# Altium project 电子天平.PrjPcb
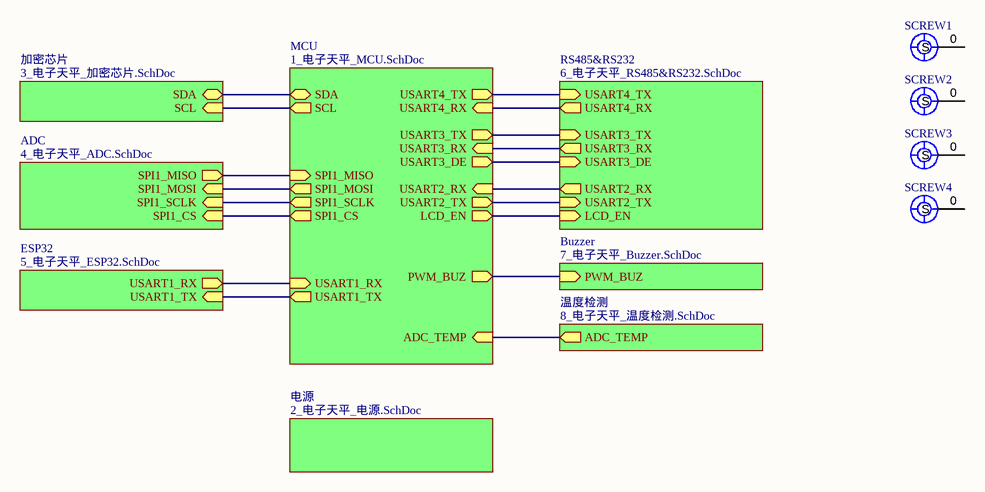
[diagram p0: 0_电子天平.SchDoc]
9 sheets, 163 parts. Net scope: hierarchical (ports join the sheet entries above them; power ports are global).
Board file: 电子天平.PcbDoc
Sheets:
  0_电子天平.SchDoc
    MCU = 1_电子天平_MCU.SchDoc
    电源 = 2_电子天平_电源.SchDoc
    加密芯片 = 3_电子天平_加密芯片.SchDoc
    ADC = 4_电子天平_ADC.SchDoc
    ESP32 = 5_电子天平_ESP32.SchDoc
    RS485&RS232 = 6_电子天平_RS485&RS232.SchDoc
    Buzzer = 7_电子天平_Buzzer.SchDoc
    温度检测 = 8_电子天平_温度检测.SchDoc

## Sheet 0_电子天平.SchDoc: 电子天平
size A4; Date: 2020/01/07; ApprovedBy: Riggin; CheckedBy: Riggin; Author: Riggin; DrawnBy: Riggin; Engineer: Riggin; DocumentNumber: 1; Revision: V1.0; SheetNumber: 1; SheetTotal: 8; Time: 14:09:34; ProjectName: 电子天平

### Parts
SCREW1  (no value)  [SCREW_M3]
SCREW2  (no value)  [SCREW_M3]
SCREW3  (no value)  [SCREW_M3]
SCREW4  (no value)  [SCREW_M3]

### Sub-sheets
ADC = 4_电子天平_ADC.SchDoc: SPI1_SCLK (in), SPI1_MOSI (in), SPI1_CS (in), SPI1_MISO (out)
Buzzer = 7_电子天平_Buzzer.SchDoc: PWM_BUZ (in)
ESP32 = 5_电子天平_ESP32.SchDoc: USART1_TX (in), USART1_RX (out)
MCU = 1_电子天平_MCU.SchDoc: SDA (bidir), SCL (out), USART2_TX (out), USART2_RX (in), PWM_BUZ (out), USART4_TX (out), USART4_RX (in), LCD_EN (out), USART3_RX (in), USART3_TX (out), USART3_DE (out), SPI1_SCLK (out), SPI1_MOSI (out), SPI1_CS (out), SPI1_MISO (in), USART1_TX (out), USART1_RX (in), ADC_TEMP (in)
RS485&RS232 = 6_电子天平_RS485&RS232.SchDoc: USART4_TX (in), USART4_RX (out), LCD_EN (in), USART3_RX (out), USART3_TX (in), USART3_DE (in), USART2_TX (in), USART2_RX (out)
加密芯片 = 3_电子天平_加密芯片.SchDoc: SDA (bidir), SCL (in)
温度检测 = 8_电子天平_温度检测.SchDoc: ADC_TEMP (out)
电源 = 2_电子天平_电源.SchDoc: no entries

### Nets
ADC_TEMP: sheet MCU/ADC_TEMP, sheet 温度检测/ADC_TEMP
LCD_EN: sheet MCU/LCD_EN, sheet RS485&RS232/LCD_EN
PWM_BUZ: sheet MCU/PWM_BUZ, sheet Buzzer/PWM_BUZ
SCL: sheet MCU/SCL, sheet 加密芯片/SCL
SDA: sheet MCU/SDA, sheet 加密芯片/SDA
SPI1_CS: sheet MCU/SPI1_CS, sheet ADC/SPI1_CS
SPI1_MISO: sheet MCU/SPI1_MISO, sheet ADC/SPI1_MISO
SPI1_MOSI: sheet MCU/SPI1_MOSI, sheet ADC/SPI1_MOSI
SPI1_SCLK: sheet MCU/SPI1_SCLK, sheet ADC/SPI1_SCLK
USART1_RX: sheet MCU/USART1_RX, sheet ESP32/USART1_RX
USART1_TX: sheet MCU/USART1_TX, sheet ESP32/USART1_TX
USART2_RX: sheet MCU/USART2_RX, sheet RS485&RS232/USART2_RX
USART2_TX: sheet MCU/USART2_TX, sheet RS485&RS232/USART2_TX
USART3_DE: sheet MCU/USART3_DE, sheet RS485&RS232/USART3_DE
USART3_RX: sheet MCU/USART3_RX, sheet RS485&RS232/USART3_RX
USART3_TX: sheet MCU/USART3_TX, sheet RS485&RS232/USART3_TX
USART4_RX: sheet MCU/USART4_RX, sheet RS485&RS232/USART4_RX
USART4_TX: sheet MCU/USART4_TX, sheet RS485&RS232/USART4_TX

Not connected (* = marked no-connect by the designer): SCREW1 0(S); SCREW2 0(S); SCREW3 0(S); SCREW4 0(S)

### Notes on the sheet
- Title
- Company:
- Address:
- 广东省广州市
- DZT Studio
- Size:
- Date:
- Drawn By:
- A4
- Riggin
- Time:
- Revision:
- Approved By:
- Sheet
- of
- Email:
- RigginLi@icloud.com
- Project:

### Library data of the parts
SCREW1-SCREW4 = SCREW: M3 螺丝孔/定位孔

## Sheet 1_电子天平_MCU.SchDoc: 电子天平_MCU
size A4; Date: 2020/01/07; ApprovedBy: Riggin; CheckedBy: Riggin; Author: Riggin; DrawnBy: Riggin; Engineer: Riggin; DocumentNumber: 2; Revision: V1.0; SheetNumber: 2; SheetTotal: 8; Time: 14:09:34; ProjectName: 电子天平
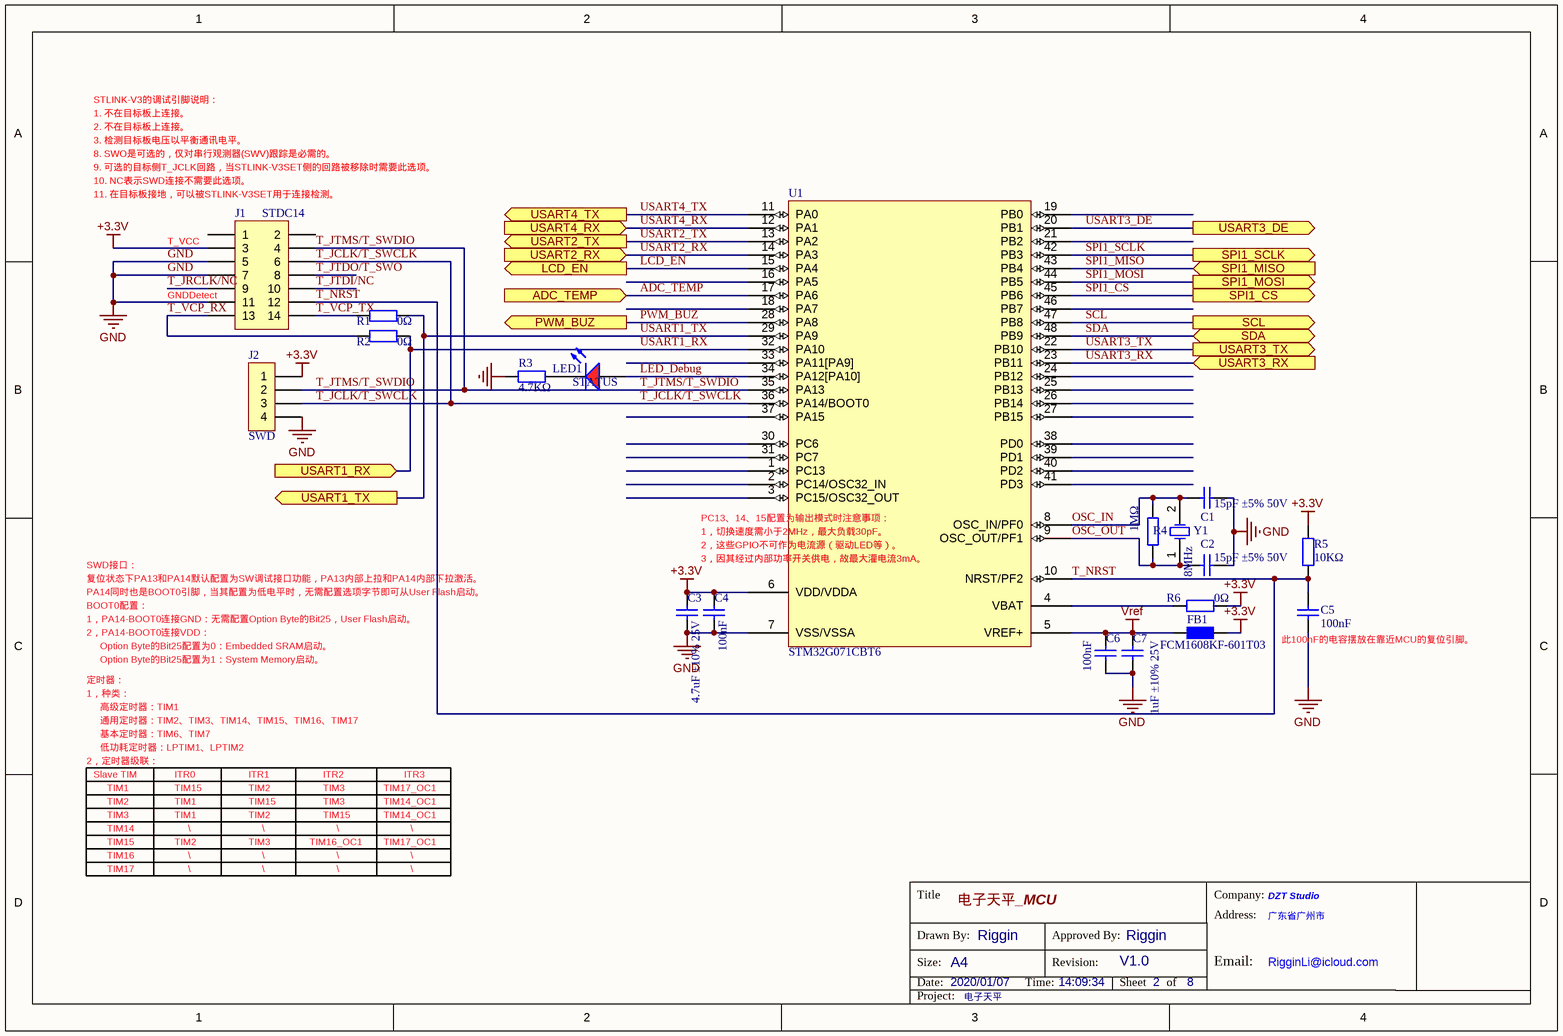
[diagram p1: 1_电子天平_MCU.SchDoc]

### Parts
C1  15pF ±5% 50V  [LC-0805_C]
C2  15pF ±5% 50V  [LC-0805_C]
C3  4.7uF ±10% 25V  [LC-0805_C]
C4  100nF  [LC-0805_C]
C5  100nF  [LC-0805_C]
C6  100nF  [LC-0805_C]
C7  1uF ±10% 25V  [LC-0805_C]
FB1  FCM1608KF-601T03  [LC-0603_L]
J1  STDC14  [CON-FTSH-107-01-L-DV-K]
J2  SWD  [CON-PH2.0-4P-DIP]
LED1  STATUS  [LC-0805_LED_S1]
R1  0Ω  [LC-0805_R]
R2  0Ω  [LC-0805_R]
R3  4.7KΩ  [LC-0805_R]
R4  1MΩ  [LC-0805_R]
R5  10KΩ  [LC-0805_R]
R6  0Ω  [LC-0805_R]
U1  STM32G071CBT6  [LC-LQFP-48_7x7x05P]
Y1  8MHz  [3225_XT_2P]

### Ports
ADC_TEMP (in), LCD_EN (out), PWM_BUZ (out), SCL (out), SDA (bidir), SPI1_CS (out), SPI1_MISO (in), SPI1_MOSI (out), SPI1_SCLK (out), USART1_RX (in), USART1_TX (out), USART2_RX (in), USART2_TX (out), USART3_DE (out), USART3_RX (in), USART3_TX (out), USART4_RX (in), USART4_TX (out)

### Nets
+3.3V: C3.1 C4.1 FB1.1 J1.3 J2.1 R5.2 R6.1 U1.6(VDD/VDDA)
GND: C1.1 C2.1 C3.2 C4.2 C5.2 C6.2 C7.2 J1.5 J1.7 J1.11 J2.4 R3.2 U1.7(VSS/VSSA)
Vref: C6.1 C7.1 FB1.2 U1.5(VREF+)
ADC_TEMP: U1.17(PA6) ; port ADC_TEMP
LCD_EN: U1.15(PA4) ; port LCD_EN
LED_Debug: LED1.A U1.34(PA12[PA10])
OSC_IN: C1.2 R4.2 U1.8(OSC_IN/PF0) Y1.2(OSC2)
OSC_OUT: C2.2 R4.1 U1.9(OSC_OUT/PF1) Y1.1(OSC1)
PWM_BUZ: U1.28(PA8) ; port PWM_BUZ
SCL: U1.47(PB8) ; port SCL
SDA: U1.48(PB9) ; port SDA
SPI1_CS: U1.45(PB6) ; port SPI1_CS
SPI1_MISO: U1.43(PB4) ; port SPI1_MISO
SPI1_MOSI: U1.44(PB5) ; port SPI1_MOSI
SPI1_SCLK: U1.42(PB3) ; port SPI1_SCLK
T_JCLK/T_SWCLK: J1.6 J2.3 U1.36(PA14/BOOT0)
T_JRCLK/NC: J1.9
T_JTDI/NC: J1.10
T_JTDO/T_SWO: J1.8
T_JTMS/T_SWDIO: J1.4 J2.2 U1.35(PA13)
T_NRST: C5.1 J1.12 R5.1 U1.10(NRST/PF2)
T_VCP_RX: J1.13 R2.2
T_VCP_TX: J1.14 R1.2
USART1_RX: R2.1 U1.32(PA10) ; port USART1_RX
USART1_TX: R1.1 U1.29(PA9) ; port USART1_TX
USART2_RX: U1.14(PA3) ; port USART2_RX
USART2_TX: U1.13(PA2) ; port USART2_TX
USART3_DE: U1.20(PB1) ; port USART3_DE
USART3_RX: U1.23(PB11) ; port USART3_RX
USART3_TX: U1.22(PB10) ; port USART3_TX
USART4_RX: U1.12(PA1) ; port USART4_RX
USART4_TX: U1.11(PA0) ; port USART4_TX
NetLED1_K: LED1.K R3.1
NetR6_2: R6.2 U1.4(VBAT)

Not connected (* = marked no-connect by the designer): J1 1 2; U1 1(PC13) 2(PC14/OSC32_IN) 3(PC15/OSC32_OUT) 16(PA5) 18(PA7) 19(PB0) 21(PB2) 24(PB12) 25(PB13) 26(PB14) 27(PB15) 30(PC6) 31(PC7) 33(PA11[PA9]) 37(PA15) 38(PD0) 39(PD1) 40(PD2) 41(PD3) 46(PB7)

### Notes on the sheet
- 1. 不在目标板上连接。
- STLINK-V3的调试引脚说明：
- 3. 检测目标板电压以平衡通讯电平。
- 8. SWO是可选的，仅对串行观测器(SWV)跟踪是必需的。
- 9. 可选的目标侧T_JCLK回路，当STLINK-V3SET侧的回路被移除时需要此选项。
- 2. 不在目标板上连接。
- 10. NC表示SWD连接不需要此选项。
- (near J1) 11. 在目标板接地，可以被STLINK-V3SET用于连接检测。
- (near J1) T_VCC
- (near J1) GNDDetect
- (near U1) PC13、14、15配置为输出模式时注意事项：
- 复位状态下PA13和PA14默认配置为SW调试接口功能，PA13内部上拉和PA14内部下拉激活。
- SWD接口：
- (near U1) 1，切换速度需小于2MHz，最大负载30pF。
- (near U1) 2，这些GPIO不可作为电流源（驱动LED等）。
- (near U1) 3，因其经过内部功率开关供电，故最大灌电流3mA。
- BOOT0配置：
- 1，PA14-BOOT0连接GND：无需配置Option Byte的Bit25，User Flash启动。
- 2，PA14-BOOT0连接VDD：
- PA14同时也是BOOT0引脚，当其配置为低电平时，无需配置选项字节即可从User Flash启动。
- Option Byte的Bit25配置为0：Embedded SRAM启动。
- (near C5) 此100nF的电容摆放在靠近MCU的复位引脚。
- 定时器：
- 1，种类：
- Option Byte的Bit25配置为1：System Memory启动。
- 高级定时器：TIM1
- 2，定时器级联：
- Slave TIM
- 通用定时器：TIM2、TIM3、TIM14、TIM15、TIM16、TIM17
- 基本定时器：TIM6、TIM7
- 低功耗定时器：LPTIM1、LPTIM2
- TIM1
- ITR0
- TIM15
- ITR1
- TIM2
- ITR2
- TIM3
- TIM17_OC1
- ITR3
- TIM14
- \
- TIM16_OC1
- TIM14_OC1
- TIM16
- TIM17
- Title
- Company:
- Address:
- 广东省广州市
- DZT Studio
- Size:
- Date:
- Drawn By:
- A4
- Riggin
- Time:
- Revision:
- Approved By:
- Sheet
- of
- Email:
- RigginLi@icloud.com
- Project:

### Library data of the parts
C1 C2 = Cap: MLCC NP0; Value: 100pF; Published: 8-Jun-2000; LatestRevisionDate: 17-Jul-2002; LatestRevisionNote: Re-released for DXP Platform.; PackageReference: RAD-0.3; Publisher: Altium Limited; PackageDescription: Radial Cap, Thru-Hole; 2 Leads; 0.3 in Pin Spacing
C3-C7 = Cap: MLCC; Value: 100pF; Published: 8-Jun-2000; LatestRevisionDate: 17-Jul-2002; LatestRevisionNote: Re-released for DXP Platform.; PackageReference: RAD-0.3; Publisher: Altium Limited; PackageDescription: Radial Cap, Thru-Hole; 2 Leads; 0.3 in Pin Spacing
FB1 = FB: 磁珠
J1 = Header 7X2: Header, 7-Pin, Dual row; LatestRevisionDate: 17-Jul-2002; LatestRevisionNote: Re-released for DXP Platform.; Publisher: Altium Limited
J2 = SIP4
LED1 = 0603: LED; ComponentLink1URL: http://www.szlcsc.com/product/details_2659.html; Package: 0603; Supplier: LC; SuppliersPartNumber: C2286
R1-R6 = Res2: Resistor; Value: 1K; Published: 8-Jun-2000; LatestRevisionDate: 17-Jul-2002; LatestRevisionNote: Re-released for DXP Platform.; PackageReference: AXIAL-0.4; Publisher: Altium Limited; PackageDescription: Axial Device, Thru-Hole; 2 Leads; 0.4 in Pin Spacing
U1 = STM32G081CBT6: 128KB Flash, 36KB RAM, 4USART,timers,ADC,DAC,comm. I/Fs,AES-256,1.65-3.6V
Y1 = SMD-5032_2P 8MHz 20ppm 2: SMD 8MHz; ComponentLink1URL: http://www.szlcsc.com/product/details_19261.html; Package: SMD-5032_2P; Supplier: LC; SuppliersPartNumber: C18560

## Sheet 2_电子天平_电源.SchDoc: 电子天平_电源
size A4; Date: 2020/01/07; ApprovedBy: Riggin; CheckedBy: Riggin; Author: Riggin; DrawnBy: Riggin; Engineer: Riggin; DocumentNumber: 3; Revision: V1.0; SheetNumber: 3; SheetTotal: 8; Time: 14:09:34; ProjectName: 电子天平
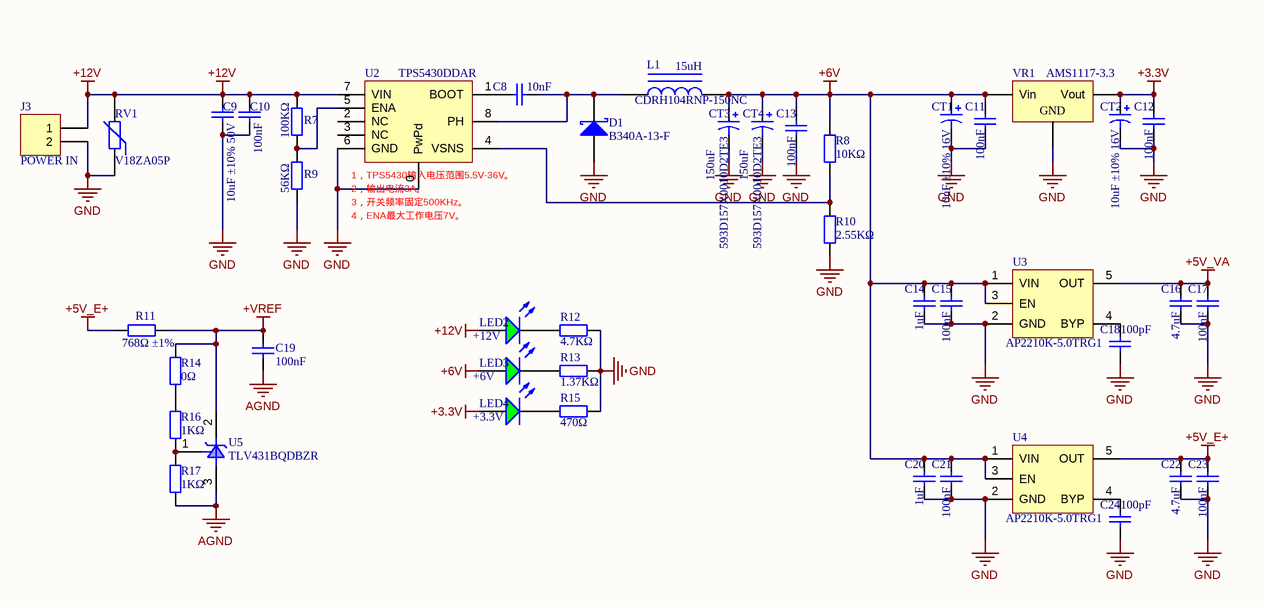
[diagram p2: 2_电子天平_电源.SchDoc]

### Parts
C8  10nF  [LC-0805_C]
C9  10uF ±10% 50V  [LC-1206_C]
C10  100nF  [LC-0805_C]
C11  100nF  [LC-0805_C]
C12  100nF  [LC-0805_C]
C13  100nF  [LC-1206_C]
C14  1uF  [LC-0805_C]
C15  100nF  [LC-0805_C]
C16  4.7uF  [LC-0805_C]
C17  100nF  [LC-0805_C]
C18  100pF  [LC-0805_C]
C19  100nF  [LC-0805_C]
C20  1uF  [LC-0805_C]
C21  100nF  [LC-0805_C]
C22  4.7uF  [LC-0805_C]
C23  100nF  [LC-0805_C]
C24  100pF  [LC-0805_C]
CT1  10uF ±10% 16V  [LC-CASE-A_3216]
CT2  10uF ±10% 16V  [LC-CASE-A_3216]
CT3  593D157X0010D2TE3  value 150uF  [LC-CASE-D_7343]
CT4  593D157X0010D2TE3  value 150uF  [LC-CASE-D_7343]
D1  B340A-13-F  [LC-SMA(DO-214AC)_S1]
J3  POWER IN  [CON-VH7.92-2P]
L1  CDRH104RNP-150NC  value 15uH  [L-CDRH104R]
LED2  +12V  [LC-0805_LED_S1]
LED3  +6V  [LC-0805_LED_S1]
LED4  +3.3V  [LC-0805_LED_S1]
R7  100KΩ  [LC-0805_R]
R8  10KΩ  [LC-0805_R]
R9  56KΩ  [LC-0805_R]
R10  2.55KΩ  [LC-0805_R]
R11  768Ω ±1%  [LC-0805_R]
R12  4.7KΩ  [LC-0805_R]
R13  1.37KΩ  [LC-0805_R]
R14  0Ω  [LC-0805_R]
R15  470Ω  [LC-0805_R]
R16  1KΩ  [LC-0805_R]
R17  1KΩ  [LC-0805_R]
RV1  V18ZA05P  [RV-V18ZA05P]
U2  TPS5430DDAR  [LC-SOP-8_EP_150mil]
U3  AP2210K-5.0TRG1  [LC-SOT-23-5]
U4  AP2210K-5.0TRG1  [LC-SOT-23-5]
U5  TLV431BQDBZR  [LC-SOT-23(SOT-23-3)]
VR1  AMS1117-3.3  [LC-SOT-223]

### Nets
+3.3V: C12.1 CT2.1 LED4.A VR1.2(Vout)
+5V_E+: C22.1 C23.1 R11.1 U4.5(OUT)
+5V_VA: C16.1 C17.1 U3.5(OUT)
+6V: C11.1 C13.1 C14.1 C15.1 C20.1 C21.1 CT1.1 CT3.1 CT4.1 L1.2 LED3.A R8.1 U3.1(VIN) U3.3(EN) U4.1(VIN) U4.3(EN) VR1.3(Vin)
+12V: C9.1 C10.1 J3.1 LED2.A R7.2 RV1.2 U2.7(VIN)
+VREF: C19.2 R11.2 R14.2 U5.2(K)
AGND: C19.1 R17.2 U5.3(A)
GND: C9.2 C10.2 C11.2 C12.2 C13.2 C14.2 C15.2 C16.2 C17.2 C18.2 C20.2 C21.2 C22.2 C23.2 C24.2 CT1.2 CT2.2 CT3.2 CT4.2 D1.1(A) J3.2 R9.1 R10.2 R12.1 R13.1 R15.1 RV1.1 U2.0(PwPd) U2.6(GND) U3.2(GND) U4.2(GND) VR1.1(GND)
NetC8_1: C8.1 U2.1(BOOT)
NetC8_2: C8.2 D1.2(K) L1.1 U2.8(PH)
NetC18_1: C18.1 U3.4(BYP)
NetC24_1: C24.1 U4.4(BYP)
NetLED2_K: LED2.K R12.2
NetLED3_K: LED3.K R13.2
NetLED4_K: LED4.K R15.2
NetR7_1: R7.1 R9.2 U2.5(ENA)
NetR8_2: R8.2 R10.1 U2.4(VSNS)
NetR14_1: R14.1 R16.2
NetR16_1: R16.1 R17.1 U5.1(R)

Not connected (* = marked no-connect by the designer): U2 2(NC) 3(NC)

### Notes on the sheet
- (near U2) 1，TPS5430输入电压范围5.5V-36V。
- (near U2) 2，输出电流3A。
- 3，开关频率固定500KHz。
- 4，ENA最大工作电压7V。
- Title
- Company:
- Address:
- 广东省广州市
- DZT Studio
- Size:
- Date:
- Drawn By:
- A4
- Riggin
- Time:
- Revision:
- Approved By:
- Sheet
- of
- Email:
- RigginLi@icloud.com
- Project:

### Library data of the parts
C8-C17 C19-C23 = Cap: MLCC; Value: 100pF; Published: 8-Jun-2000; LatestRevisionDate: 17-Jul-2002; LatestRevisionNote: Re-released for DXP Platform.; PackageReference: RAD-0.3; Publisher: Altium Limited; PackageDescription: Radial Cap, Thru-Hole; 2 Leads; 0.3 in Pin Spacing
C18 C24 = Cap: MLCC; Published: 8-Jun-2000; LatestRevisionDate: 17-Jul-2002; LatestRevisionNote: Re-released for DXP Platform.; PackageReference: RAD-0.3; Publisher: Altium Limited; PackageDescription: Radial Cap, Thru-Hole; 2 Leads; 0.3 in Pin Spacing; Value: 100pF
CT1-CT4 = Cap Pol1: 钽电容; Published: 8-Jun-2000; LatestRevisionDate: 17-Jul-2002; LatestRevisionNote: Re-released for DXP Platform.; PackageReference: RB7.6-15; Publisher: Altium Limited
  CT1 CT2: Value: 10uF
D1 = D Schottky: 肖特基二极管; Published: 8-Jun-2000; LatestRevisionDate: 17-Jul-2002; LatestRevisionNote: Re-released for DXP Platform.; PackageReference: SMB; Publisher: Altium Limited; Code_JEDEC: DO-214-AA
J3 = Header 2: Header, 2-Pin; LatestRevisionDate: 17-Jul-2002; LatestRevisionNote: Re-released for DXP Platform.; Publisher: Altium Limited
L1 = Inductor Iron: Magnetic-Core Inductor; Published: 24-Mar-1999; LatestRevisionDate: 17-Jul-2002; LatestRevisionNote: Re-released for DXP Platform.; PackageReference: AXIAL-0.9; Publisher: Altium Limited
LED2-LED4 = 0805 翠绿: 发光二极管; ComponentLink1Description: 供应商链接; ComponentLink1URL: http://www.szlcsc.com/product/details_2670.html; Package: 0805; Supplier: LC; SuppliersPartNumber: C2297
R7-R11 = Res2: Resistor; Value: 1K; Published: 8-Jun-2000; LatestRevisionDate: 17-Jul-2002; LatestRevisionNote: Re-released for DXP Platform.; PackageReference: AXIAL-0.4; Publisher: Altium Limited; PackageDescription: Axial Device, Thru-Hole; 2 Leads; 0.4 in Pin Spacing
R12 R13 R15 = 0805 47KΩ (4702) 1%: 贴片电阻; ComponentLink1Description: 供应商链接; ComponentLink1URL: http://www.szlcsc.com/product/details_18401.html; Package: 0805; Supplier: LC; SuppliersPartNumber: C17713
R14 R16 R17 = 0805 470KΩ (4703) 1%: 贴片电阻; ComponentLink1Description: 供应商链接; ComponentLink1URL: http://www.szlcsc.com/product/details_18397.html; Package: 0805; Supplier: LC; SuppliersPartNumber: C17709
RV1 = Res Varistor: Varistor (Voltage-Sensitive Resistor); Published: 24-Mar-1999; LatestRevisionDate: 29-May-2009; LatestRevisionNote: IPC-7351 Footprint Added.; PackageVersion: Mar-2003; PackageReference: 6-0805; Publisher: Altium Limited; PackageDescription: Chip Resistor 0805 Case Size; Code_IPC: RESC2012
U2 = TPS5430DDAR: 5.5V to 36V Input, 3A, Step-Down DC-DC
U3 U4 = SPX3819M5-L-5-0/TR: 5.0V固定输出，低压差700mV@Iout=500mA，Vin=16V
U5 = CJ431 0.5%431: 电压基准; ComponentLink1Description: 供应商链接; ComponentLink1URL: http://www.szlcsc.com/product/details_3500.html; Package: SOT-23; Supplier: LC; SuppliersPartNumber: C3113
VR1 = SOT-223 AMS1117-3.3: 低压差线性稳压(LDO); ComponentLink1Description: 供应商链接; ComponentLink1URL: http://www.szlcsc.com/product/details_6652.html; Package: SOT-223; Supplier: LC; SuppliersPartNumber: C6186

## Sheet 3_电子天平_加密芯片.SchDoc: 电子天平_加密芯片
size A4; Date: 2020/01/07; ApprovedBy: Riggin; CheckedBy: Riggin; Author: Riggin; DrawnBy: Riggin; Engineer: Riggin; DocumentNumber: 4; Revision: V1.0; SheetNumber: 4; SheetTotal: 8; Time: 14:09:34; ProjectName: 电子天平
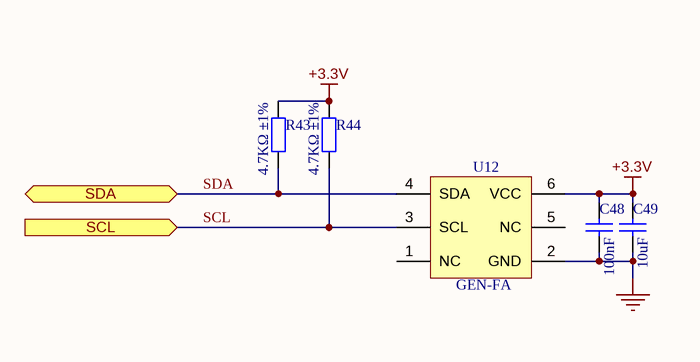
[diagram p3: 3_电子天平_加密芯片.SchDoc]

### Parts
C48  100nF  [LC-0805_C]
C49  10uF  [LC-0805_C]
R43  4.7KΩ ±1%  [LC-0805_R]
R44  4.7KΩ ±1%  [LC-0805_R]
U12  GEN-FA  [LC-SOT-23-6]

### Ports
SCL (in), SDA (bidir)

### Nets
+3.3V: C48.1 C49.1 R43.1 R44.1 U12.6(VCC)
GND: C48.2 C49.2 U12.2(GND)
SCL: R44.2 U12.3(SCL) ; port SCL
SDA: R43.2 U12.4(SDA) ; port SDA

Not connected (* = marked no-connect by the designer): U12 1(NC) 5(NC)

### Notes on the sheet
- Title
- Company:
- Address:
- 广东省广州市
- DZT Studio
- Size:
- Date:
- Drawn By:
- A4
- Riggin
- Time:
- Revision:
- Approved By:
- Sheet
- of
- Email:
- RigginLi@icloud.com
- Project:

### Library data of the parts
C48 C49 = Cap: MLCC; Value: 100pF; Published: 8-Jun-2000; LatestRevisionDate: 17-Jul-2002; LatestRevisionNote: Re-released for DXP Platform.; PackageReference: RAD-0.3; Publisher: Altium Limited; PackageDescription: Radial Cap, Thru-Hole; 2 Leads; 0.3 in Pin Spacing
R43 R44 = Res2: Resistor; Value: 1K; Published: 8-Jun-2000; LatestRevisionDate: 17-Jul-2002; LatestRevisionNote: Re-released for DXP Platform.; PackageReference: AXIAL-0.4; Publisher: Altium Limited; PackageDescription: Axial Device, Thru-Hole; 2 Leads; 0.4 in Pin Spacing
U12 = ALPU-FA: neowine加密芯片  带32Kbits EEPROM。

## Sheet 4_电子天平_ADC.SchDoc: 电子天平_ADC
size A4; Date: 2020/01/07; ApprovedBy: Riggin; CheckedBy: Riggin; Author: Riggin; DrawnBy: Riggin; Engineer: Riggin; DocumentNumber: 5; Revision: V1.0; SheetNumber: 5; SheetTotal: 8; Time: 14:09:34; ProjectName: 电子天平
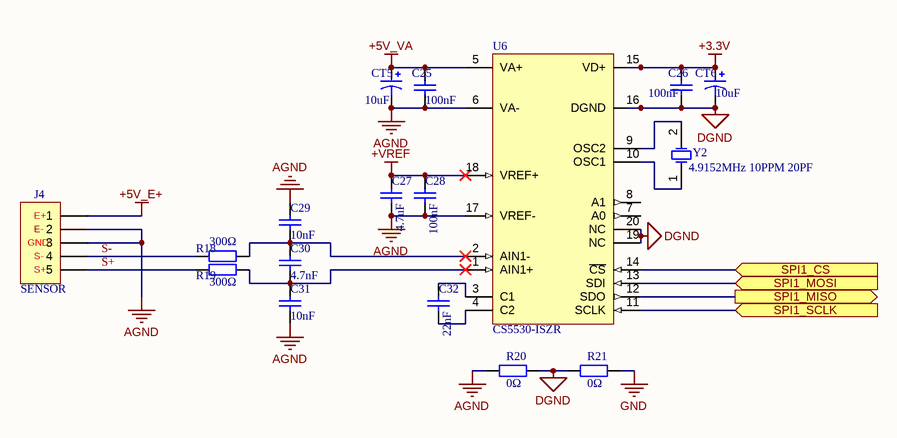
[diagram p4: 4_电子天平_ADC.SchDoc]

### Parts
C25  100nF  [LC-0805_C]
C26  100nF  [LC-0805_C]
C27  4.7uF  [LC-0805_C]
C28  100nF  [LC-0805_C]
C29  10nF  [LC-0805_C]
C30  4.7nF  [LC-0805_C]
C31  10nF  [LC-0805_C]
C32  22nF  [LC-0805_C]
CT5  10uF  [LC-CASE-A_3216]
CT6  10uF  [LC-CASE-A_3216]
J4  SENSOR
R18  300Ω  [LC-0805_R]
R19  300Ω  [LC-0805_R]
R20  0Ω  [LC-0402_R]
R21  0Ω  [LC-0402_R]
U6  CS5530-ISZR  [LC-SSOP-20_208mil]
Y2  value 4.9152MHz 10PPM 20PF  [LC-HC-49SMD]  (hidden comment: 49MD-4.9152-20-10-10/B)

### Ports
SPI1_CS (in), SPI1_MISO (out), SPI1_MOSI (in), SPI1_SCLK (in)

### Nets
+3.3V: C26.1 CT6.1 U6.15(VD+)
+5V_E+: J4.1
+5V_VA: C25.1 CT5.1 U6.5(VA+)
+VREF: C27.1 C28.1 U6.18(VREF+)
AGND: C25.2 C27.2 C28.2 C29.2 C31.1 CT5.2 J4.2 J4.3 R20.2 U6.6(VA-) U6.17(VREF-)
DGND: C26.2 CT6.2 R20.1 R21.2 U6.16(DGND) U6.19(NC) U6.20(NC)
GND: R21.1
S+: J4.5 R19.2
S-: J4.4 R18.2
SPI1_CS: U6.14(~{CS}) ; port SPI1_CS
SPI1_MISO: U6.12(SDO) ; port SPI1_MISO
SPI1_MOSI: U6.13(SDI) ; port SPI1_MOSI
SPI1_SCLK: U6.11(SCLK) ; port SPI1_SCLK
NetC29_1: C29.1 C30.2 R18.1 U6.2(AIN1-)
NetC30_1: C30.1 C31.2 R19.1 U6.1(AIN1+)
NetC32_1: C32.1 U6.4(C2)
NetC32_2: C32.2 U6.3(C1)
NetU6_9: U6.9(OSC2) Y2.2(OSC2)
NetU6_10: U6.10(OSC1) Y2.1(OSC1)

Not connected (* = marked no-connect by the designer): U6 7(A0) 8(A1)

### Notes on the sheet
- (near J4) E+
- (near J4) GND
- (near J4) E-
- (near J4) S-
- (near J4) S+
- Title
- Company:
- Address:
- 广东省广州市
- DZT Studio
- Size:
- Date:
- Drawn By:
- A4
- Riggin
- Time:
- Revision:
- Approved By:
- Sheet
- of
- Email:
- RigginLi@icloud.com
- Project:

### Library data of the parts
C25-C32 = Cap: MLCC; Value: 100pF; Published: 8-Jun-2000; LatestRevisionDate: 17-Jul-2002; LatestRevisionNote: Re-released for DXP Platform.; PackageReference: RAD-0.3; Publisher: Altium Limited; PackageDescription: Radial Cap, Thru-Hole; 2 Leads; 0.3 in Pin Spacing
CT5 CT6 = Cap Pol1: 钽电容; Published: 8-Jun-2000; LatestRevisionDate: 17-Jul-2002; LatestRevisionNote: Re-released for DXP Platform.; PackageReference: RB7.6-15; Publisher: Altium Limited; Value: 10uF
J4 = Header 5: Header, 5-Pin; LatestRevisionDate: 17-Jul-2002; LatestRevisionNote: Re-released for DXP Platform.; Publisher: Altium Limited
R18-R21 = Res2: Resistor; Value: 1K; Published: 8-Jun-2000; LatestRevisionDate: 17-Jul-2002; LatestRevisionNote: Re-released for DXP Platform.; PackageReference: AXIAL-0.4; Publisher: Altium Limited; PackageDescription: Axial Device, Thru-Hole; 2 Leads; 0.4 in Pin Spacing
U6 = CS5530: 24bits模数转换芯片
Y2 = SMD-5032_2P 11.0592MHZ 20PF 20PPM: 贴片无源晶振; ComponentLink1Description: 供应商链接; ComponentLink1URL: http://www.szlcsc.com/product/details_53039.html; Package: SMD-5032_2P; Supplier: LC; SuppliersPartNumber: C52026

## Sheet 5_电子天平_ESP32.SchDoc: 电子天平_ESP32
size A4; Date: 2020/01/07; ApprovedBy: Riggin; CheckedBy: Riggin; Author: Riggin; DrawnBy: Riggin; Engineer: Riggin; DocumentNumber: 6; Revision: V1.0; SheetNumber: 6; SheetTotal: 8; Time: 14:09:34; ProjectName: 电子天平
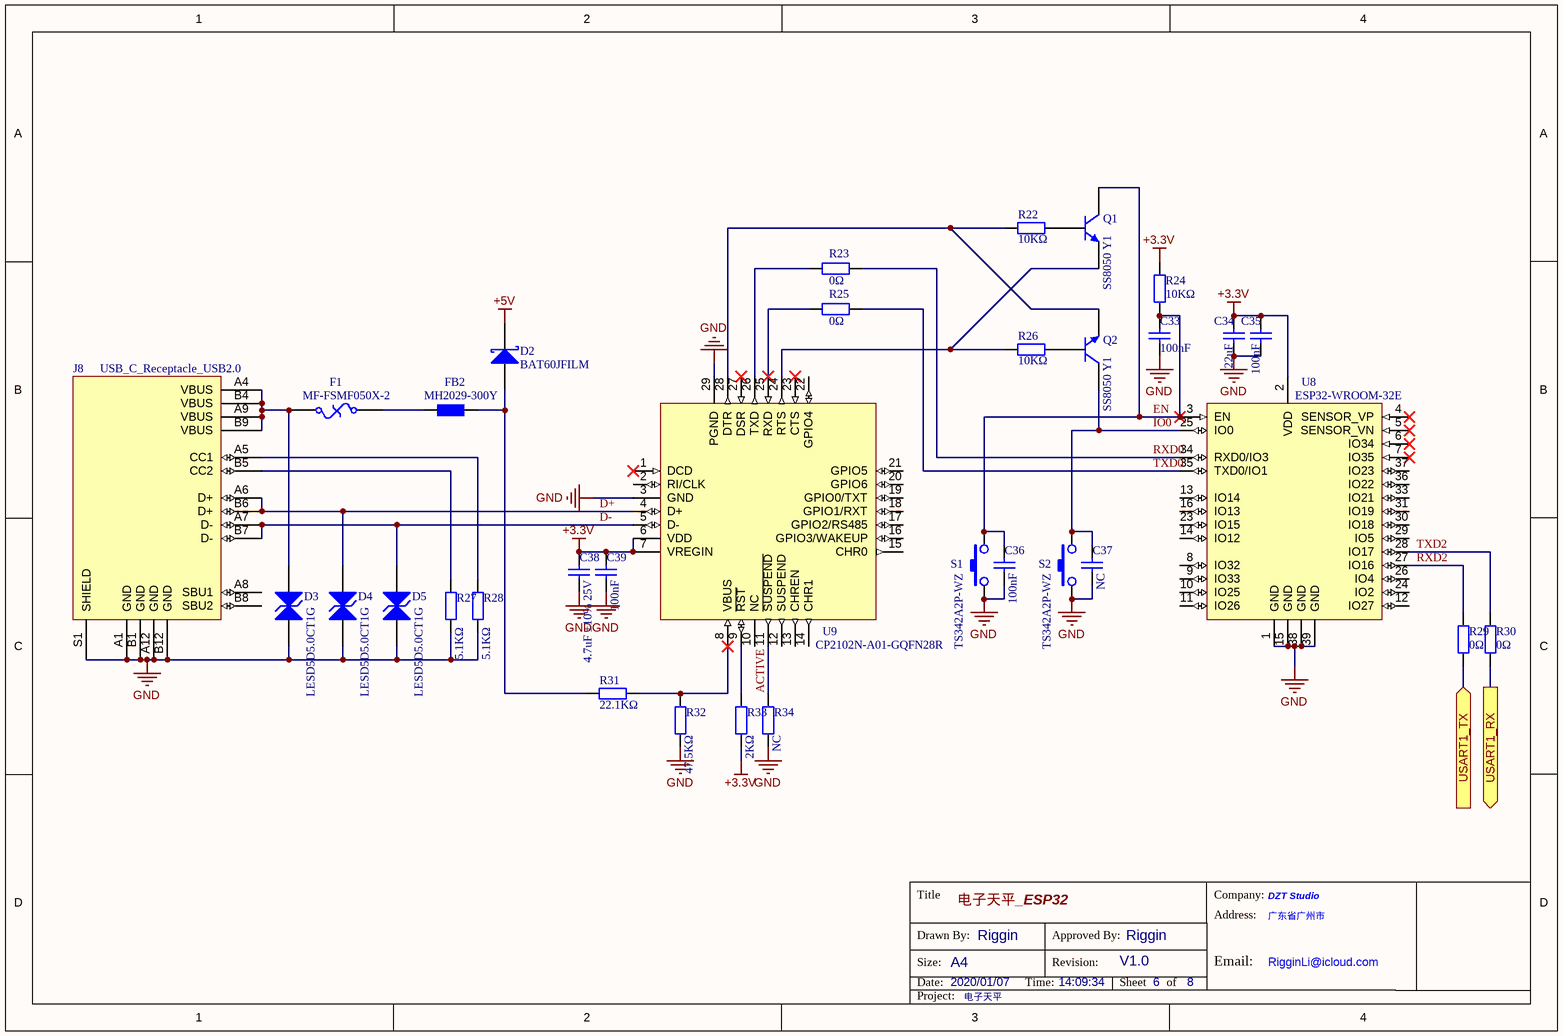
[diagram p5: 5_电子天平_ESP32.SchDoc]

### Parts
C33  100nF  [LC-0805_C]
C34  22uF  [LC-1206_C]
C35  100nF  [LC-0805_C]
C36  100nF  [LC-0805_C]
C37  NC  [LC-0805_C]
C38  4.7uF ±10% 25V  [LC-0805_C]
C39  100nF  [LC-0805_C]
D2  BAT60JFILM  [LC-SOD-323]
D3  LESD5D5.0CT1G  [LC-SOD-523]
D4  LESD5D5.0CT1G  [LC-SOD-523]
D5  LESD5D5.0CT1G  [LC-SOD-523]
F1  MF-FSMF050X-2  [LC-0603]
FB2  MH2029-300Y  [LC-0805_L]
J8  USB_C_Receptacle_USB2.0
Q1  SS8050 Y1  [LC-SOT-23(SOT-23-3)]
Q2  SS8050 Y1  [LC-SOT-23(SOT-23-3)]
R22  10KΩ  [LC-0805_R]
R23  0Ω  [LC-0805_R]
R24  10KΩ  [LC-0805_R]
R25  0Ω  [LC-0805_R]
R26  10KΩ  [LC-0805_R]
R27  5.1KΩ  [LC-0805_R]
R28  5.1KΩ  [LC-0805_R]
R29  0Ω  [LC-0805_R]
R30  0Ω  [LC-0805_R]
R31  22.1KΩ  [LC-0805_R]
R32  47.5KΩ  [LC-0805_R]
R33  2KΩ  [LC-0805_R]
R34  NC  [LC-0805_R]
S1  TS342A2P-WZ  [SW-REST-KEY]
S2  TS342A2P-WZ  [SW-REST-KEY]
U8  ESP32-WROOM-32E
U9  CP2102N-A01-GQFN28R  [LC-QFN-28_5x5x05P]

### Ports
USART1_RX (out), USART1_TX (in)

### Nets
+3.3V: C34.1 C35.1 C38.1 C39.1 R24.2 R33.1 U8.2(VDD) U9.6(VDD) U9.7(VREGIN)
+5V: D2.2(K)
GND: C33.2 C34.2 C35.2 C36.2 C37.2 C38.2 C39.2 D3.1(A) D4.1(A) D5.1(A) J8.A1(GND) J8.A12(GND) J8.B1(GND) J8.B12(GND) J8.S1(SHIELD) R27.2 R28.2 R32.1 R34.1 S1.1 S2.1 U8.1(GND) U8.15(GND) U8.38(GND) U8.39(GND) U9.3(GND) U9.29(PGND)
ACTIVE: R34.2 U9.11(~{SUSPEND})
D+: D4.2(K) J8.A6(D+) J8.B6(D+) U9.4(D+)
D-: D5.2(K) J8.A7(D-) J8.B7(D-) U9.5(D-)
EN: C33.1 C36.1 Q1.3(C) R24.1 S1.2 U8.3(EN)
IO0: C37.1 Q2.3(C) S2.2 U8.25(IO0)
RXD0: R23.1 U8.34(RXD0/IO3)
RXD2: R29.1 U8.27(IO16)
TXD0: R25.1 U8.35(TXD0/IO1)
TXD2: R30.1 U8.28(IO17)
USART1_RX: R30.2 ; port USART1_RX
USART1_TX: R29.2 ; port USART1_TX
NetD2_1: D2.1(A) FB2.2 R31.1
NetD3_2: D3.2(K) F1.2 J8.A4(VBUS) J8.A9(VBUS) J8.B4(VBUS) J8.B9(VBUS)
NetF1_1: F1.1 FB2.1
NetJ8_A5: J8.A5(CC1) R28.1
NetJ8_B5: J8.B5(CC2) R27.1
NetQ1_1: Q1.1(B) R22.1
NetQ1_2: Q1.2(E) R26.2 U9.24(RTS)
NetQ2_1: Q2.1(B) R26.1
NetQ2_2: Q2.2(E) R22.2 U9.28(DTR)
NetR23_2: R23.2 U9.26(TXD)
NetR25_2: R25.2 U9.25(RXD)
NetR31_2: R31.2 R32.2 U9.8(VBUS)
NetR33_2: R33.2 U9.9(~{RST})

Not connected (* = marked no-connect by the designer): J8 A8(SBU1) B8(SBU2); U8 4(SENSOR_VP)* 5(SENSOR_VN)* 6(IO34)* 7(IO35)* 8(IO32) 9(IO33) 10(IO25) 11(IO26) 12(IO27) 13(IO14) 14(IO12) 16(IO13) 17(NC) 18(NC) 19(NC) 20(NC) 21(NC) 22(NC) 23(IO15) 24(IO2) 26(IO4) 29(IO5) 30(IO18) 31(IO19) 32(NC) 33(IO21) 36(IO22) 37(IO23); U9 1(DCD)* 2(RI/CLK) 10(NC) 12(SUSPEND) 13(CHREN) 14(CHR1) 15(CHR0) 16(GPIO3/WAKEUP) 17(GPIO2/RS485) 18(GPIO1/RXT) 19(GPIO0/TXT) 20(GPIO6) 21(GPIO5) 22(GPIO4) 23(CTS)* 27(DSR)*

### Notes on the sheet
- Title
- Company:
- Address:
- 广东省广州市
- DZT Studio
- Size:
- Date:
- Drawn By:
- A4
- Riggin
- Time:
- Revision:
- Approved By:
- Sheet
- of
- Email:
- RigginLi@icloud.com
- Project:

### Library data of the parts
C33-C35 C38 C39 = Cap: MLCC; Value: 100pF; Published: 8-Jun-2000; LatestRevisionDate: 17-Jul-2002; LatestRevisionNote: Re-released for DXP Platform.; PackageReference: RAD-0.3; Publisher: Altium Limited; PackageDescription: Radial Cap, Thru-Hole; 2 Leads; 0.3 in Pin Spacing
C36 C37 = Cap: Capacitor-0.1uF±10%/50V; Value: 100pF; Published: 8-Jun-2000; LatestRevisionDate: 17-Jul-2002; LatestRevisionNote: Re-released for DXP Platform.; PackageReference: RAD-0.3; Publisher: Altium Limited; PackageDescription: Radial Cap, Thru-Hole; 2 Leads; 0.3 in Pin Spacing
D2 = D Schottky: Schottky Diode; Published: 8-Jun-2000; LatestRevisionDate: 17-Jul-2002; LatestRevisionNote: Re-released for DXP Platform.; PackageReference: SMB; Publisher: Altium Limited; Code_JEDEC: DO-214-AA
D3-D5 = SMB/DO-214AA P6SMB6.8CA: ESD二极管; ComponentLink1Description: 供应商链接; ComponentLink1URL: http://www.szlcsc.com/product/details_79530.html; Package: SMB/DO-214AA; Supplier: LC; SuppliersPartNumber: C78395
F1 = Fuse Thermal: 自恢复保险丝; Published: 24-Mar-1999; LatestRevisionDate: 17-Jul-2002; LatestRevisionNote: Re-released for DXP Platform.; PackageReference: PIN-W2/E2.8; Publisher: Altium Limited
FB2 = FB: 磁珠
J8 = USB_C_Receptacle_USB2.0: USB TypeC 连接器
Q1 Q2 = SOT-23 SS8050 Y1: 三极管; ComponentLink1Description: 供应商链接; ComponentLink1URL: http://www.szlcsc.com/product/details_2507.html; Package: SOT-23; Supplier: LC; SuppliersPartNumber: C2150
R22-R34 = Res2: Resistor; Value: 1K; Published: 8-Jun-2000; LatestRevisionDate: 17-Jul-2002; LatestRevisionNote: Re-released for DXP Platform.; PackageReference: AXIAL-0.4; Publisher: Altium Limited; PackageDescription: Axial Device, Thru-Hole; 2 Leads; 0.4 in Pin Spacing
S1 S2 = SW: Tact Switch; 高?: 7mm
U8 = ESP32-WROOM-32E: ESP32模组
U9 = CP2102N-A01-GQFN28R: USB芯片

## Sheet 6_电子天平_RS485&RS232.SchDoc: 电子天平_RS485&RS232
size A4; Date: 2020/01/07; ApprovedBy: Riggin; CheckedBy: Riggin; Author: Riggin; DrawnBy: Riggin; Engineer: Riggin; DocumentNumber: 7; Revision: V1.0; SheetNumber: 7; SheetTotal: 8; Time: 14:09:34; ProjectName: 电子天平
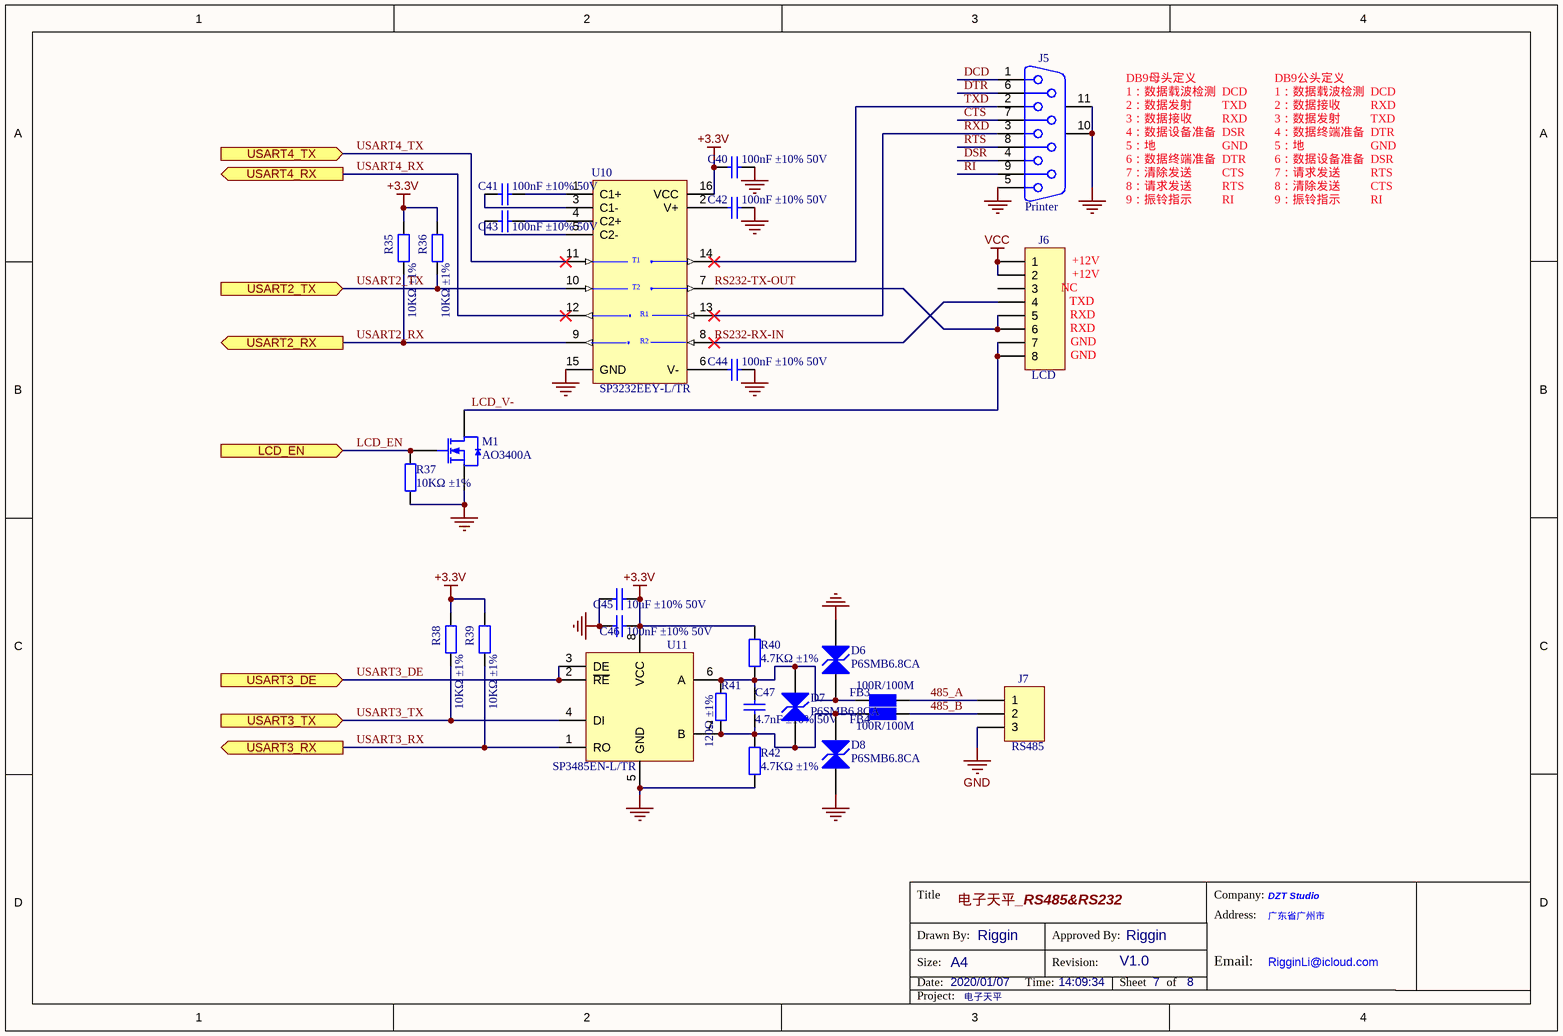
[diagram p6: 6_电子天平_RS485&RS232.SchDoc]

### Parts
C40  100nF ±10% 50V  [LC-0603_C]
C41  100nF ±10% 50V  [LC-0603_C]
C42  100nF ±10% 50V  [LC-0603_C]
C43  100nF ±10% 50V  [LC-0603_C]
C44  100nF ±10% 50V  [LC-0603_C]
C45  10uF ±10% 50V  [LC-1206_C]
C46  100nF ±10% 50V  [LC-0805_C]
C47  4.7nF ±10% 50V  [LC-0805_C]
D6  P6SMB6.8CA  [LC-SMB(DO-214AA)_S1]
D7  P6SMB6.8CA  [LC-SMB(DO-214AA)_S1]
D8  P6SMB6.8CA  [LC-SMB(DO-214AA)_S1]
FB3  100R/100M  [LC-0805_L]
FB4  100R/100M  [LC-0805_L]
J5  Printer  [CON-DB9_Female]
J6  LCD  [CON-A2505WR-8P]
J7  RS485
M1  AO3400A  [LC-SOT-23(SOT-23-3)]
R35  10KΩ ±1%  [LC-0805_R]
R36  10KΩ ±1%  [LC-0805_R]
R37  10KΩ ±1%  [LC-0805_R]
R38  10KΩ ±1%  [LC-0805_R]
R39  10KΩ ±1%  [LC-0805_R]
R40  4.7KΩ ±1%  [LC-0805_R]
R41  120Ω ±1%  [LC-0805_R]
R42  4.7KΩ ±1%  [LC-0805_R]
U10  SP3232EEY-L/TR  [LC-TSSOP-16]
U11  SP3485EN-L/TR  [LC-SOIC-8_150mil]

### Ports
LCD_EN (in), USART2_RX (out), USART2_TX (in), USART3_DE (in), USART3_RX (out), USART3_TX (in), USART4_RX (out), USART4_TX (in)

### Nets
+3.3V: C40.2 C45.2 C46.1 R35.1 R36.1 R38.1 R39.1 R40.2 U10.16(VCC) U11.8(VCC)
GND: C40.1 C42.2 C44.2 C45.1 C46.2 D6.1(A) D8.1(A) J5.5 J5.10(MH1) J5.11(MH2) J7.3 M1.2(S) R37.2 R42.1 U10.15(GND) U11.5(GND)
VCC: J6.1 J6.2
485_A: FB3.1 J7.1
485_B: FB4.1 J7.2
CTS: J5.7
DCD: J5.1
DSR: J5.4
DTR: J5.6
LCD_EN: M1.1(G) R37.1 ; port LCD_EN
LCD_V-: J6.7 J6.8 M1.3(D)
RI: J5.9
RS232-RX-IN: J6.4 U10.8(R2IN)
RS232-TX-OUT: J6.5 J6.6 U10.7(T2OUT)
RTS: J5.8
RXD: J5.3 U10.13(R1IN)
TXD: J5.2 U10.14(T1OUT)
USART2_RX: R35.2 U10.9(R2OUT) ; port USART2_RX
USART2_TX: R36.2 U10.10(T2IN) ; port USART2_TX
USART3_DE: U11.2(~{RE}) U11.3(DE) ; port USART3_DE
USART3_RX: R39.2 U11.1(RO) ; port USART3_RX
USART3_TX: R38.2 U11.4(DI) ; port USART3_TX
USART4_RX: U10.12(R1OUT) ; port USART4_RX
USART4_TX: U10.11(T1IN) ; port USART4_TX
NetC41_1: C41.1 U10.3(C1-)
NetC41_2: C41.2 U10.1(C1+)
NetC42_1: C42.1 U10.2(V+)
NetC43_1: C43.1 U10.5(C2-)
NetC43_2: C43.2 U10.4(C2+)
NetC44_1: C44.1 U10.6(V-)
NetC47_1: C47.1 D7.2(K) D8.2(K) FB4.2 R41.1 R42.2 U11.7(B)
NetC47_2: C47.2 D6.2(K) D7.1(A) FB3.2 R40.1 R41.2 U11.6(A)

Not connected (* = marked no-connect by the designer): J6 3

### Notes on the sheet
- 1：数据载波检测  DCD
- 2：数据发射          TXD
- DB9母头定义
- 2：数据接收          RXD
- DB9公头定义
- 3：数据接收          RXD
- 6：数据终端准备  DTR
- 5：地                      GND
- 4：数据设备准备  DSR
- 7：清除发送          CTS
- 3：数据发射          TXD
- 4：数据终端准备  DTR
- 6：数据设备准备  DSR
- 7：请求发送          RTS
- 8：请求发送          RTS
- 9：振铃指示          RI
- 8：清除发送          CTS
- (near J6) NC
- (near J6) TXD
- (near J6) +12V
- (near J6) RXD
- (near J6) GND
- Title
- Company:
- Address:
- 广东省广州市
- DZT Studio
- Size:
- Date:
- Drawn By:
- A4
- Riggin
- Time:
- Revision:
- Approved By:
- Sheet
- of
- Email:
- RigginLi@icloud.com
- Project:
- (in symbol MAX232AESE) T1; T2; R1; R2

### Library data of the parts
C40-C47 = Cap: MLCC; Value: 100pF; Published: 8-Jun-2000; LatestRevisionDate: 17-Jul-2002; LatestRevisionNote: Re-released for DXP Platform.; PackageReference: RAD-0.3; Publisher: Altium Limited; PackageDescription: Radial Cap, Thru-Hole; 2 Leads; 0.3 in Pin Spacing
D6-D8 = SMB/DO-214AA P6SMB6.8CA: TVS; ComponentLink1Description: 供应商链接; ComponentLink1URL: http://www.szlcsc.com/product/details_79530.html; Package: SMB/DO-214AA; Supplier: LC; SuppliersPartNumber: C78395
FB3 FB4 = FB: 磁珠
J5 = D Connector 9: Receptacle Assembly, 9 Position, Right Angle; PackageDocument: O; Positions: 9; Published: 15-Jun-2001; LatestRevisionDate: 17-Jul-2002; LatestRevisionNote: Re-released for DXP Platform.; DatasheetDocument: 1-Sep-1999; PackageReference: 788750; Publisher: Altium Limited; Orientation: Right Angle; Gender: Receptacle
J6 = Header 8H: Header, 8-Pin, Right Angle; LatestRevisionDate: 17-Jul-2002; LatestRevisionNote: Re-released for DXP Platform.; Publisher: Altium Limited
J7 = Header 3: Header, 3-Pin; LatestRevisionDate: 17-Jul-2002; LatestRevisionNote: Re-released for DXP Platform.; Publisher: Altium Limited
M1 = AO3400A N道沟 X0YV1T SOT-23: MOS(场效应管); ComponentLink1Description: 供应商链接; ComponentLink1URL: http://www.szlcsc.com/product/details_21629.html; Package: SOT-23; Supplier: LC; SuppliersPartNumber: C20917
R35-R42 = Res2: Resistor; Value: 1K; Published: 8-Jun-2000; LatestRevisionDate: 17-Jul-2002; LatestRevisionNote: Re-released for DXP Platform.; PackageReference: AXIAL-0.4; Publisher: Altium Limited; PackageDescription: Axial Device, Thru-Hole; 2 Leads; 0.4 in Pin Spacing
U10 = MAX232AESE: +5V-Powered, Multichannel RS-232 Driver/Receiver; Published: 16-Jan-2001; LatestRevisionDate: 13-Apr-2006; LatestRevisionNote: IPC-7351 Footprint Added.; DatasheetVersion: Nov-1997; PackageReference: NSO16; Publisher: Altium Limited; PackageDescription: 16-Pin Small Outline Integrated Circuit 1.27 mm Pitch; Code_JEDEC: MS-012-AC; Code_IPC: SOIC127P600-16; ComponentLink1Description: Manufacturer Link; ComponentLink1URL: http://www.maxim-ic.com/; ComponentLink2Description: Datasheet; ComponentLink2URL: http://pdfserv.maxim-ic.com/en/ds/MAX220-MAX249.pdf
U11 = SP3485EN: RS485

## Sheet 7_电子天平_Buzzer.SchDoc: 电子天平_Buzzer
size A4; Date: 2020/01/07; ApprovedBy: Riggin; CheckedBy: Riggin; Author: Riggin; DrawnBy: Riggin; Engineer: Riggin; DocumentNumber: 8; Revision: V1.0; SheetNumber: 8; SheetTotal: 8; Time: 14:09:34; ProjectName: 电子天平
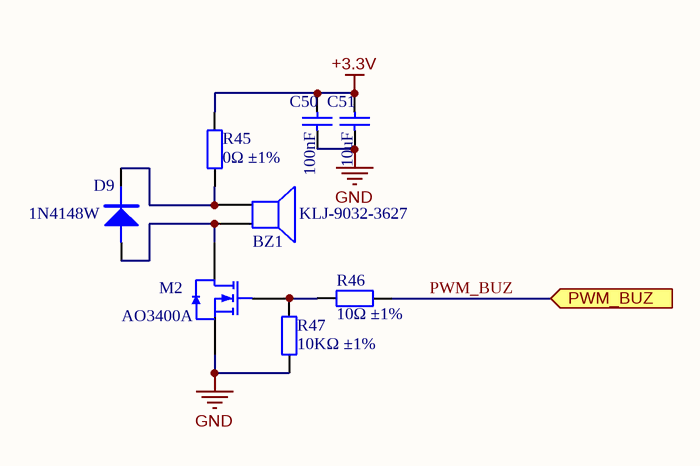
[diagram p7: 7_电子天平_Buzzer.SchDoc]

### Parts
BZ1  KLJ-9032-3627  [BUZZER_SMD1]
C50  100nF  [LC-0805_C]
C51  10uF  [LC-1206_C]
D9  1N4148W  [LC-SOD-123]
M2  AO3400A  [LC-SOT-23(SOT-23-3)]
R45  0Ω ±1%  [LC-0805_R]
R46  10Ω ±1%  [LC-0805_R]
R47  10KΩ ±1%  [LC-0805_R]

### Ports
PWM_BUZ (in)

### Nets
+3.3V: C50.1 C51.1 R45.2
GND: C50.2 C51.2 M2.2(S) R47.2
PWM_BUZ: R46.2 ; port PWM_BUZ
NetBZ1_1: BZ1.1 D9.K R45.1
NetBZ1_2: BZ1.2 D9.A M2.3(D)
NetM2_1: M2.1(G) R46.1 R47.1

### Notes on the sheet
- Title
- Company:
- Address:
- 广东省广州市
- DZT Studio
- Size:
- Date:
- Drawn By:
- A4
- Riggin
- Time:
- Revision:
- Approved By:
- Sheet
- of
- Email:
- RigginLi@icloud.com
- Project:

### Library data of the parts
BZ1 = Speaker: 额定电压3.6V  谐振频率2731Hz  线圈电阻16Ω; Published: 24-Mar-1999; LatestRevisionDate: 17-Jul-2002; LatestRevisionNote: Re-released for DXP Platform.; PackageReference: PIN2; Publisher: Altium Limited
C50 C51 = Cap: MLCC; Value: 100pF; Published: 8-Jun-2000; LatestRevisionDate: 17-Jul-2002; LatestRevisionNote: Re-released for DXP Platform.; PackageReference: RAD-0.3; Publisher: Altium Limited; PackageDescription: Radial Cap, Thru-Hole; 2 Leads; 0.3 in Pin Spacing
D9 = DIODE: 100V，150mA，VF=1.25V@150mA
M2 = AO3400A N道沟 X0YV1T SOT-23: MOS(场效应管); ComponentLink1Description: 供应商链接; ComponentLink1URL: http://www.szlcsc.com/product/details_21629.html; Package: SOT-23; Supplier: LC; SuppliersPartNumber: C20917
R45-R47 = Res2: Resistor; Value: 1K; Published: 8-Jun-2000; LatestRevisionDate: 17-Jul-2002; LatestRevisionNote: Re-released for DXP Platform.; PackageReference: AXIAL-0.4; Publisher: Altium Limited; PackageDescription: Axial Device, Thru-Hole; 2 Leads; 0.4 in Pin Spacing

## Sheet 8_电子天平_温度检测.SchDoc: 电子天平_温度检测
size A4; Date: 2020/01/07; ApprovedBy: Riggin; CheckedBy: Riggin; Author: Riggin; DrawnBy: Riggin; Engineer: Riggin; DocumentNumber: 1; Revision: V1.0; SheetNumber: 1; SheetTotal: 8; Time: 14:09:34; ProjectName: 电子天平
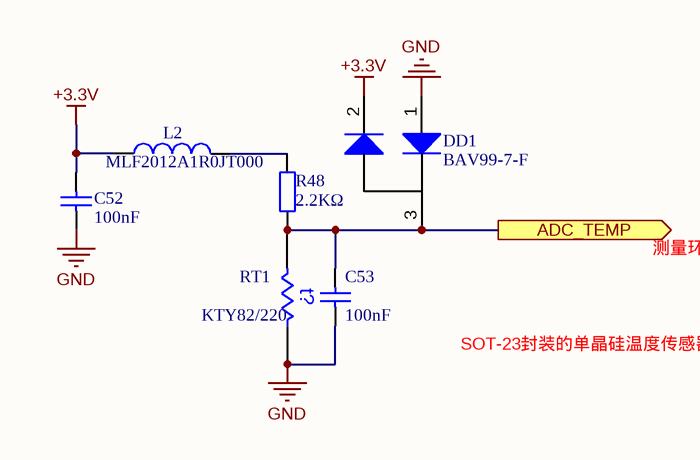
[diagram p8: 8_电子天平_温度检测.SchDoc]

### Parts
C52  100nF  [LC-0805_C]
C53  100nF  [LC-0805_C]
DD1  BAV99-7-F  [LC-SOT-23(SOT-23-3)]
L2  MLF2012A1R0JT000  [LC-0805_L]
R48  2.2KΩ  [LC-0805_R]
RT1  KTY82/220  [LC-SOT-23(SOT-23-3)]

### Ports
ADC_TEMP (out)

### Nets
+3.3V: C52.2 DD1.2(A) L2.2
GND: C52.1 C53.1 DD1.1(A) RT1.1
ADC_TEMP: C53.2 DD1.3(K) R48.1 RT1.2 ; port ADC_TEMP
NetL2_1: L2.1 R48.2

### Notes on the sheet
- 测量环境温度。
- (near RT1) SOT-23封装的单晶硅温度传感器（正温度系数）
- Title
- Company:
- Address:
- 广东省广州市
- DZT Studio
- Size:
- Date:
- Drawn By:
- A4
- Riggin
- Time:
- Revision:
- Approved By:
- Sheet
- of
- Email:
- RigginLi@icloud.com
- Project:
- (in symbol Res Thermal) t?

### Library data of the parts
C52 C53 = Cap: MLCC; Value: 100pF; Published: 8-Jun-2000; LatestRevisionDate: 17-Jul-2002; LatestRevisionNote: Re-released for DXP Platform.; PackageReference: RAD-0.3; Publisher: Altium Limited; PackageDescription: Radial Cap, Thru-Hole; 2 Leads; 0.3 in Pin Spacing
DD1 = SOT-23 BAV99 A7W: 开关二极管; ComponentLink1Description: 供应商链接; ComponentLink1URL: http://www.szlcsc.com/product/details_2877.html; Package: SOT-23; Supplier: LC; SuppliersPartNumber: C2500
L2 = Inductor: 贴片电感; Code_IEC: 1005; Value: 10mH; Published: 8-Jun-2000; LatestRevisionDate: 29-May-2009; LatestRevisionNote: IPC-7351 Footprint Added.; PackageReference: 0402-A; Publisher: Altium Limited; PackageDescription: Chip Inductor; Code_JEITA: 0402
R48 = 0805 470KΩ (4703) 1%: 贴片电阻; ComponentLink1Description: 供应商链接; ComponentLink1URL: http://www.szlcsc.com/product/details_18397.html; Package: 0805; Supplier: LC; SuppliersPartNumber: C17709
RT1 = Res Thermal: Thermistor; Published: 24-Mar-1999; LatestRevisionDate: 29-May-2009; LatestRevisionNote: IPC-7351 Footprint Added.; PackageVersion: Mar-2003; PackageReference: 6-0805; Publisher: Altium Limited; PackageDescription: Chip Resistor 0805 Case Size; Code_IPC: RESC2012

## Nets that join several sheets
+3.3V: 1_电子天平_MCU (8 pins), 2_电子天平_电源 (C12.1 CT2.1 LED4.A VR1.2), 3_电子天平_加密芯片 (5 pins), 4_电子天平_ADC (C26.1 CT6.1 U6.15), 5_电子天平_ESP32 (9 pins), 6_电子天平_RS485&RS232 (10 pins), 7_电子天平_Buzzer (C50.1 C51.1 R45.2), 8_电子天平_温度检测 (C52.2 DD1.2 L2.2)
+5V_E+: 2_电子天平_电源 (C22.1 C23.1 R11.1 U4.5), 4_电子天平_ADC (J4.1)
+5V_VA: 2_电子天平_电源 (C16.1 C17.1 U3.5), 4_电子天平_ADC (C25.1 CT5.1 U6.5)
+VREF: 2_电子天平_电源 (C19.2 R11.2 R14.2 U5.2), 4_电子天平_ADC (C27.1 C28.1 U6.18)
AGND: 2_电子天平_电源 (C19.1 R17.2 U5.3), 4_电子天平_ADC (11 pins)
GND: 1_电子天平_MCU (13 pins), 2_电子天平_电源 (32 pins), 3_电子天平_加密芯片 (C48.2 C49.2 U12.2), 4_电子天平_ADC (R21.1), 5_电子天平_ESP32 (27 pins), 6_电子天平_RS485&RS232 (16 pins), 7_电子天平_Buzzer (C50.2 C51.2 M2.2 R47.2), 8_电子天平_温度检测 (C52.1 C53.1 DD1.1 RT1.1)
ADC_TEMP: 1_电子天平_MCU (U1.17), 8_电子天平_温度检测 (C53.2 DD1.3 R48.1 RT1.2)
LCD_EN: 1_电子天平_MCU (U1.15), 6_电子天平_RS485&RS232 (M1.1 R37.1)
PWM_BUZ: 1_电子天平_MCU (U1.28), 7_电子天平_Buzzer (R46.2)
SCL: 1_电子天平_MCU (U1.47), 3_电子天平_加密芯片 (R44.2 U12.3)
SDA: 1_电子天平_MCU (U1.48), 3_电子天平_加密芯片 (R43.2 U12.4)
SPI1_CS: 1_电子天平_MCU (U1.45), 4_电子天平_ADC (U6.14)
SPI1_MISO: 1_电子天平_MCU (U1.43), 4_电子天平_ADC (U6.12)
SPI1_MOSI: 1_电子天平_MCU (U1.44), 4_电子天平_ADC (U6.13)
SPI1_SCLK: 1_电子天平_MCU (U1.42), 4_电子天平_ADC (U6.11)
USART1_RX: 1_电子天平_MCU (R2.1 U1.32), 5_电子天平_ESP32 (R30.2)
USART1_TX: 1_电子天平_MCU (R1.1 U1.29), 5_电子天平_ESP32 (R29.2)
USART2_RX: 1_电子天平_MCU (U1.14), 6_电子天平_RS485&RS232 (R35.2 U10.9)
USART2_TX: 1_电子天平_MCU (U1.13), 6_电子天平_RS485&RS232 (R36.2 U10.10)
USART3_DE: 1_电子天平_MCU (U1.20), 6_电子天平_RS485&RS232 (U11.2 U11.3)
USART3_RX: 1_电子天平_MCU (U1.23), 6_电子天平_RS485&RS232 (R39.2 U11.1)
USART3_TX: 1_电子天平_MCU (U1.22), 6_电子天平_RS485&RS232 (R38.2 U11.4)
USART4_RX: 1_电子天平_MCU (U1.12), 6_电子天平_RS485&RS232 (U10.12)
USART4_TX: 1_电子天平_MCU (U1.11), 6_电子天平_RS485&RS232 (U10.11)